# EAGLE design Grove-Base-for-ESPr-Developer (EAGLE 7.6.0)
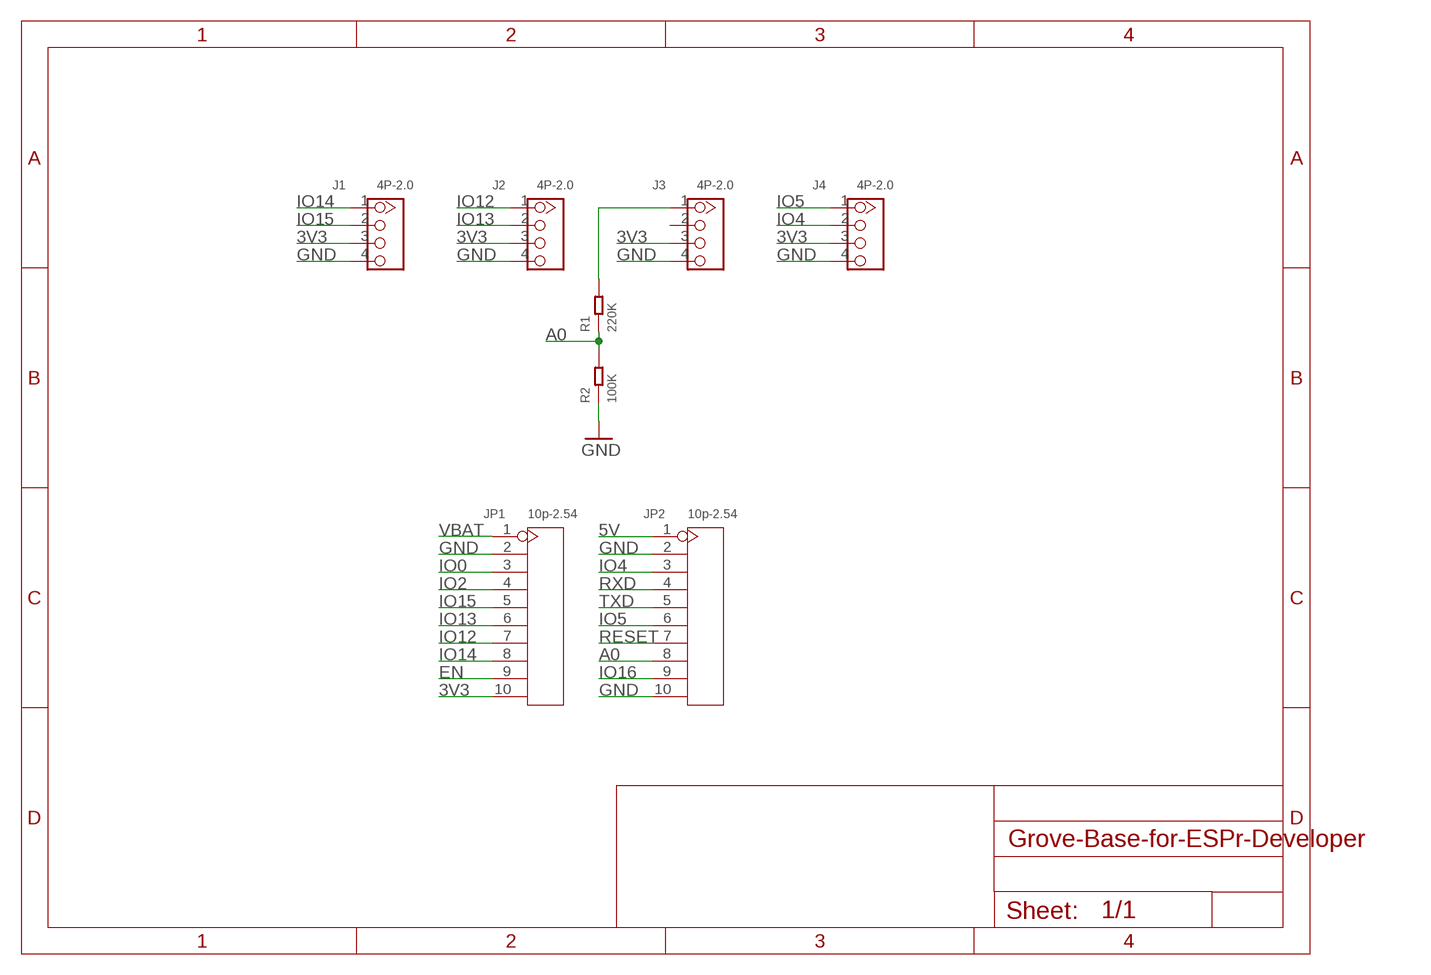
[diagram p0: schematic, sheet 1]

## Parts
J1  4P-2.0  GROVE-CONNECTOR-DIP(4P-2.0)  [HW4-2.0]
J2  4P-2.0  GROVE-CONNECTOR-DIP(4P-2.0)  [HW4-2.0]
J3  4P-2.0  GROVE-CONNECTOR-DIP(4P-2.0)  [HW4-2.0]
J4  4P-2.0  GROVE-CONNECTOR-DIP(4P-2.0)  [HW4-2.0]
JP1  10p-2.54  DIP-BLACK-MALE-HEADER-VERT(10P-2.54)  [H10-2.54]
JP2  10p-2.54  DIP-BLACK-MALE-HEADER-VERT(10P-2.54)  [H10-2.54]
R1  220K  SMD-RES-220K-1%-1/10W(0603)  [R0603]
R2  100K  SMD-RES-100K-1%-1/10W(0603)  [R0603]

## Nets
3V3: J1.3 J2.3 J3.3 J4.3 JP1.10
5V: JP2.1
A0: JP2.8 R1.1 R2.2
EN: JP1.9
GND: J1.4 J2.4 J3.4 J4.4 JP1.2 JP2.2 JP2.10 R2.1
IO0: JP1.3
IO2: JP1.4
IO4: J4.2 JP2.3
IO5: J4.1 JP2.6
IO12: J2.1 JP1.7
IO13: J2.2 JP1.6
IO14: J1.1 JP1.8
IO15: J1.2 JP1.5
IO16: JP2.9
N$5: J3.1 R1.2
RESET: JP2.7
RXD: JP2.4
TXD: JP2.5
VBAT: JP1.1
Unconnected: J3.2

## Library data of the parts
J1-J4 = Seeed-OPL-Connector:GROVE-CONNECTOR-DIP(4P-2.0): 320110033
JP1 JP2 = Seeed-OPL-Connector:DIP-BLACK-MALE-HEADER-VERT(10P-2.54): 320020050; MPN: P125-1110A0BS116AX
R1 = Seeed-OPL-Resistor:SMD-RES-220K-1%-1/10W(0603): 301010685; MPN: RC0603FR-07220KL
R2 = Seeed-OPL-Resistor:SMD-RES-100K-1%-1/10W(0603): 301010196; MPN: RC0603FR-07100KL

## Board
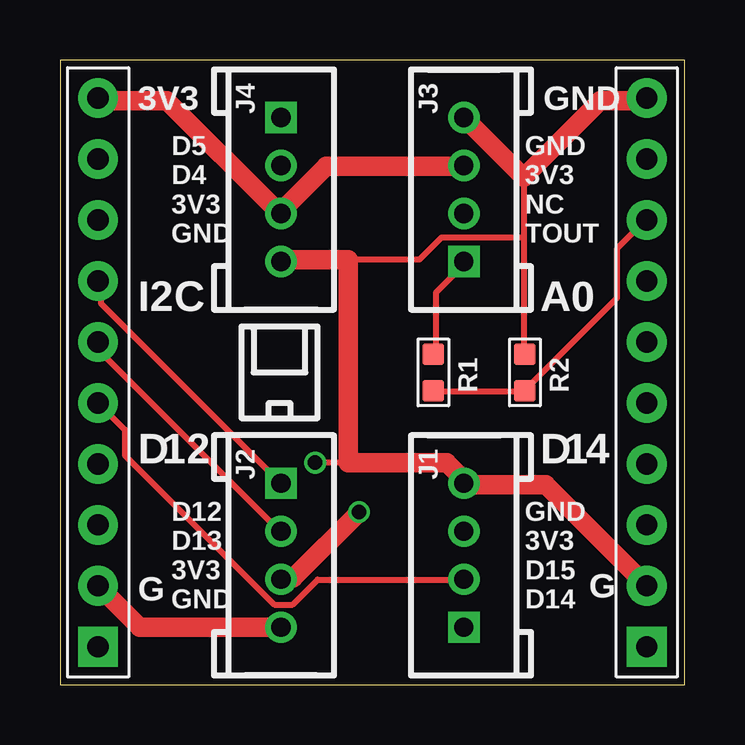
[diagram p1: board, top side]
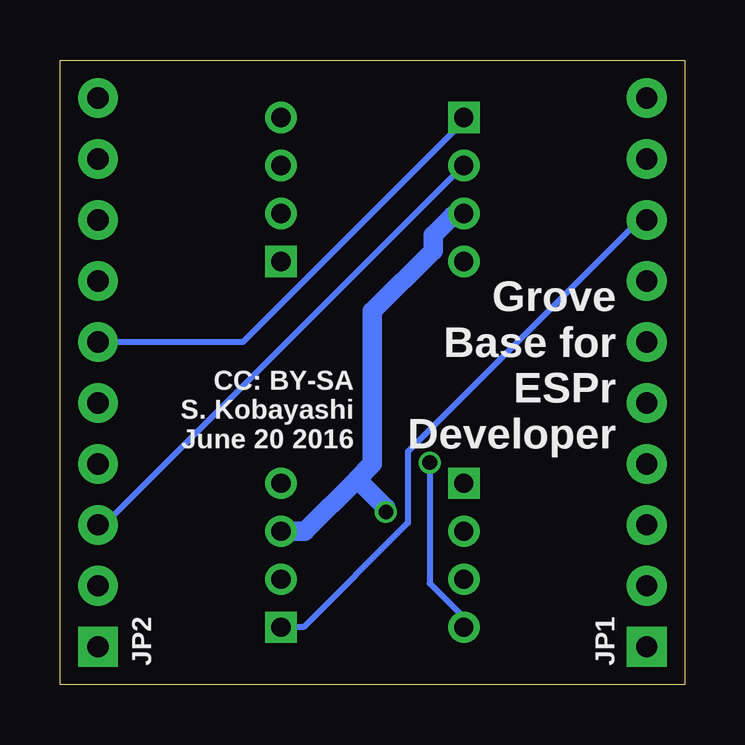
[diagram p2: board, bottom side, seen from below]

Size 26.04 x 26.04 mm. Coordinates in mm from the lower left corner, seen from the top.
Outline: 26.04,26.04 0,26.04 0,0 26.04,0.01 26.04,26.04
Copper layers (1*16): Top 0.035mm / dielectric 1.5mm / Bottom 0.035mm
Design rules "SeeedStudio_2layer_DRU_no_angle_20140221": minimum track width 6mil, minimum drill 12mil, track to track 6mil, track to pad 6mil, pad to pad 6mil, via to via 6mil, smd to smd 0mil, copper to edge 10mil, drill to drill 10mil, minimum pad ring 10mil, minimum via ring 6mil, stop-mask expansion 2mil, vias tented up to drill 100mil, thermal gap 10mil

### Footprints (pad centres in the part's own frame; a part is rotated, then mirrored left to right if it is on the bottom)
HW4-2.0 = drill 0.8 pad 1.27 square: 1 -3,0 | drill 0.8 pad 1.27: 2 -1,0; 3 1,0; 4 3,0
H10-2.54 = drill 0.889 pad 1.651 square: 1 0,11.43 | drill 0.889 pad 1.651: 2 0,8.89; 3 0,6.35; 4 0,3.81; 5 0,1.27; 6 0,-1.27; 7 0,-3.81; 8 0,-6.35; 9 0,-8.89; 10 0,-11.43
R0603 = smd 0.889 x 0.889: 1 0,0.762; 2 0,-0.762

### Placement (x,y rotation side)
J1  16.83,5.4 90 top
J2  9.21,5.4 270 top
J3  16.83,20.64 90 top
J4  9.21,20.64 270 top
JP1  1.59,13.02 180 top
JP2  24.45,13.02 180 top
R1  15.56,13.02 180 top
R2  19.37,13.02 0 top

### Tracks (layer width: path | path; a pad name or v marks a point on that pad's centre or on a via)
3V3  (via drill 0.61)
  Top 0.254: 16.8,21.6 J3.3 | 9.26,19.77 J4.3 9.03,19.77
  Top 0.813: 16.8,21.6 11.09,21.6 9.26,19.77 | v12.46,7.2 9.72,4.46 9.26,4.46 J2.3 | 9.03,19.77 4.46,24.35 1.71,24.35 JP1.10
  Bottom 0.254: 9.26,19.55 J4.3
  Bottom 0.813: J1.3 15.83,6.4 13.65,8.57 | 13.65,8.57 13.02,9.21 13.02,15.56 10.48,18.1 10.48,18.73 9.66,19.55 9.26,19.55 | v12.46,7.2 12.46,7.38 13.65,8.57
A0
  Top 0.254: R1.1 15.66,12.23 19.32,12.23 R2.2 19.55,12.46 23.2,16.12 23.2,18.17 24.35,19.32 JP2.8
GND  (via drill 0.61)
  Top 0.254: 19.32,21.15 19.32,18.63 | 19.32,18.63 19.32,13.83 R2.1 | 12,17.72 14.97,17.72 15.89,18.63 19.32,18.63 | 9.03,2.4 J2.4 | 12,9.26 v10.63,9.26 | 16.8,8.57 J1.4
  Top 0.813: J3.4 17.03,23.43 19.32,21.15 22.52,24.35 24.35,24.35 JP2.10 | J4.4 9.26,17.72 12,17.72 12,9.26 16.12,9.26 16.8,8.57 | 9.03,2.4 3.31,2.4 JP1.2 | JP2.2 20.23,8.34 17.03,8.34 J1.4
  Bottom 0.254: v10.63,9.26 10.63,4.23 9.26,2.86 9.26,2.4 J2.4
IO4
  Bottom 0.254: J4.2 9.26,21.6 24.35,6.52 JP2.3
IO5
  Bottom 0.254: JP2.6 18.4,14.29 9.26,23.43 J4.1
IO12
  Top 0.254: 9.26,8.34 J2.1 9.03,8.57 1.71,15.89 1.71,16.8 JP1.7
IO13
  Top 0.254: J2.2 9.03,6.52 1.71,13.83 1.71,14.29 JP1.6
IO14
  Bottom 0.254: J1.1 16.8,2.4 15.89,2.4 11.54,6.74 11.54,9.72 1.71,19.55 JP1.8
IO15
  Top 0.152: 16.73,4.38 J1.2
  Top 0.254: 16.73,4.38 10.73,4.38 9.69,3.34 8.93,3.34 2.71,9.56 2.71,10.63 JP1.5
N$5
  Top 0.254: R1.2 15.66,13.83 15.66,16.34 16.8,17.49 J3.1

### Text on the board
tNames: 3V3 | GND | D5 / D4 / 3V3 / GND | GND / 3V3 / NC / TOUT | I2C | A0 | D | 1 | 2 | D | 1 | 4 | G | D12 / D13 / 3V3 / GND | GND / 3V3 / D15 / D14 | G
bNames: Grove / Base for / ESPr / Developer | CC: BY-SA / S. Kobayashi / June 20 2016